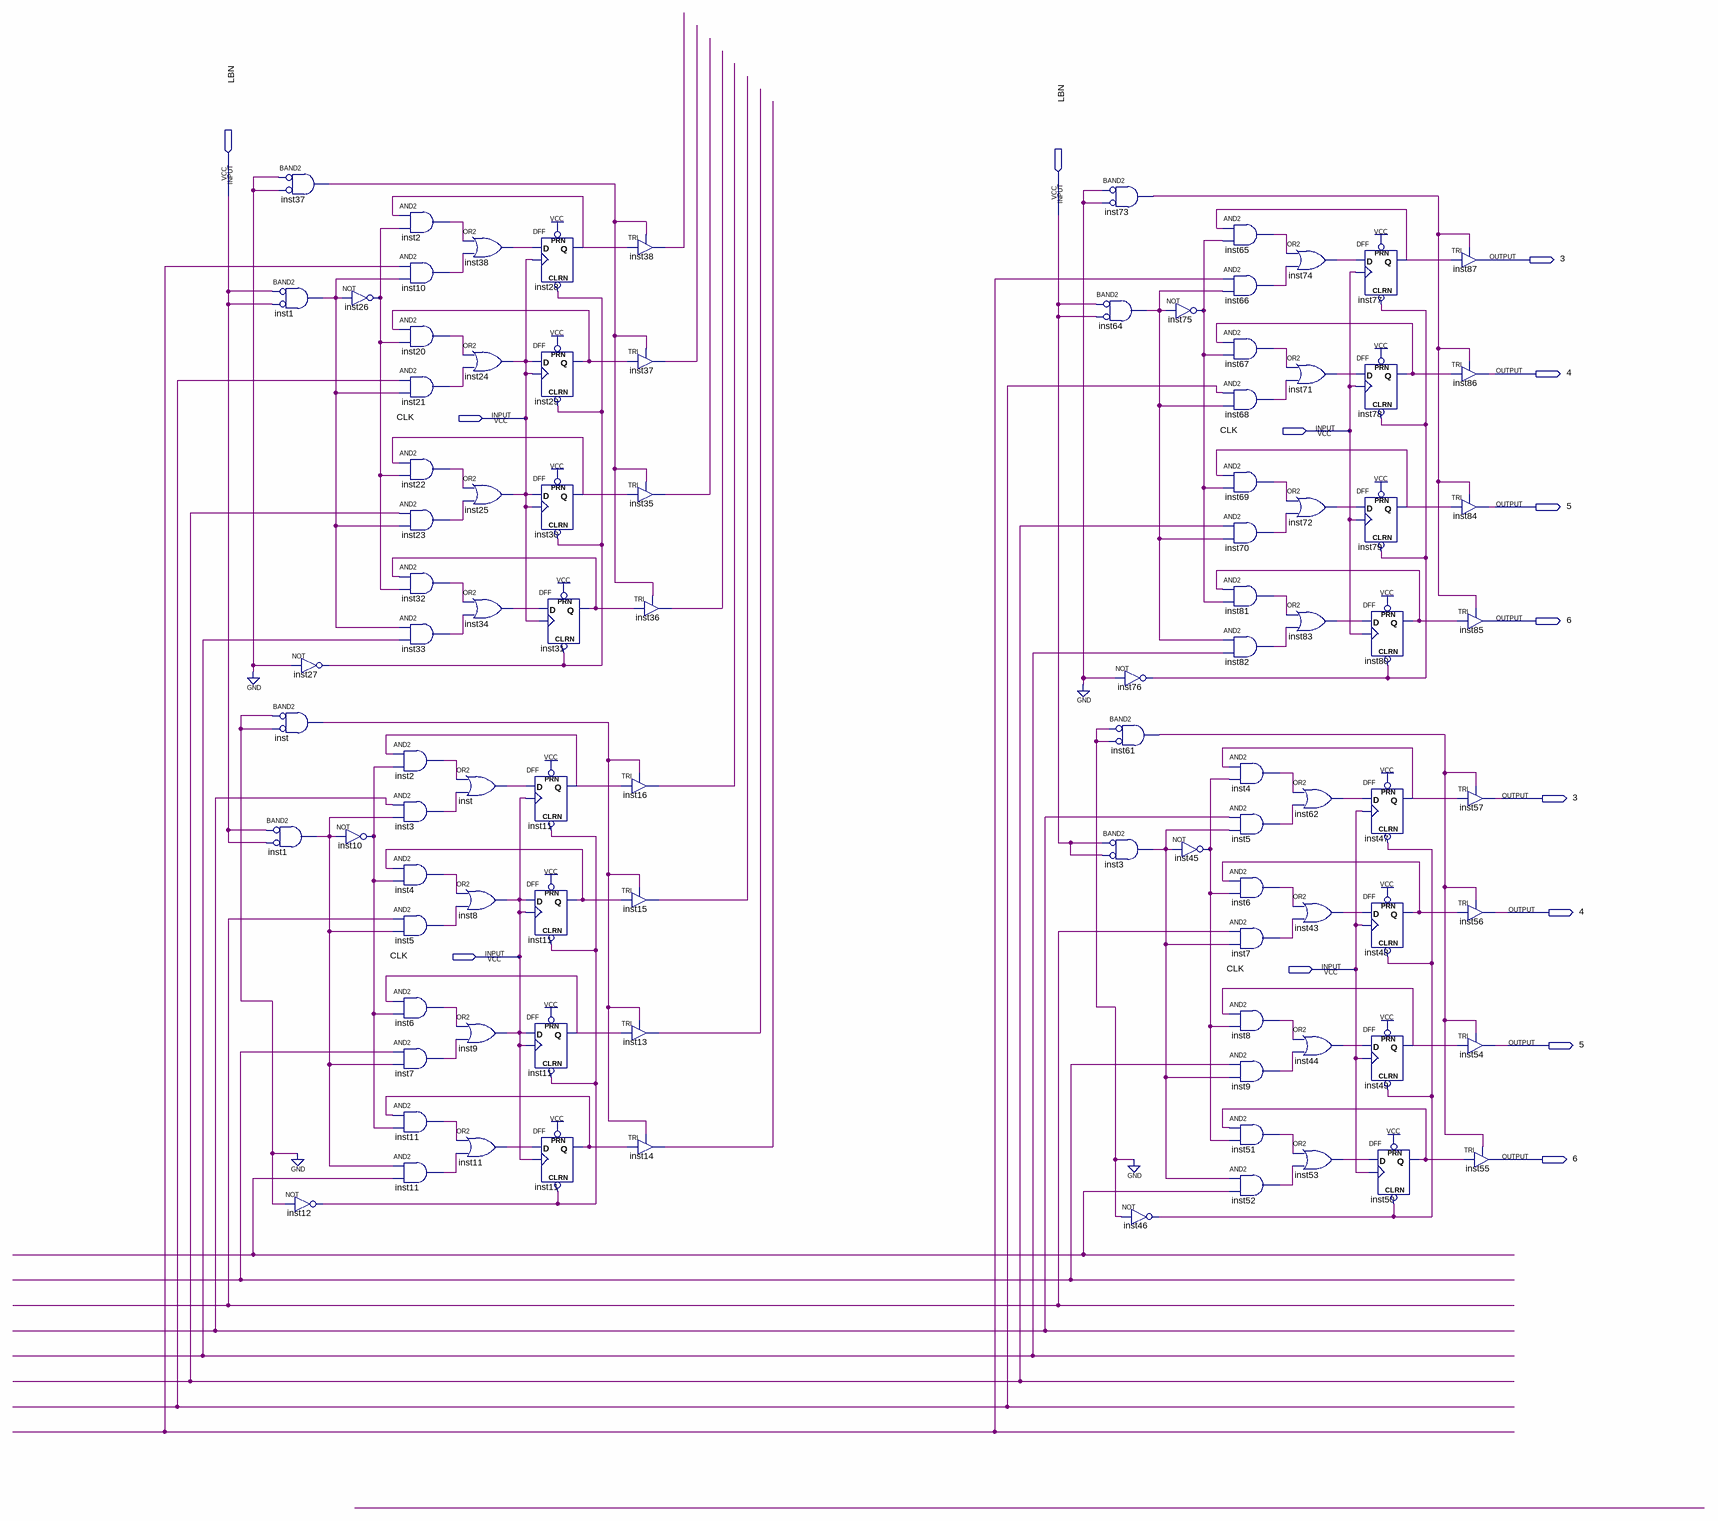
[diagram p0: schematic sheet]
// Quartus schematic Registrator.bdf as structural Verilog: 96 symbols, 14 pins
module Registrator (
  input  LBN,
  input  CLK,
  output \3 ,
  output \4 ,
  output \5 ,
  output \6 
);

  wire inst1_out, inst1_out_2, inst2_out, inst2_out_2, inst3_out, inst3_out_2, inst4_out, inst4_out_2,
       inst5_out, inst5_out_2, inst6_out, inst6_out_2, inst7_out, inst7_out_2, inst8_out, inst9_out,
       inst10_out, inst10_out_2, inst11_out, inst11_out_2, inst11_out_3, inst11_q, inst11_q_2, inst11_q_3,
       inst11_q_4, inst12_out, inst13_out, inst14_out, inst15_out, inst16_out, inst20_out, inst21_out,
       inst22_out, inst23_out, inst26_out, inst27_out, inst28_q, inst29_q, inst30_q, inst31_q, inst32_out,
       inst33_out, inst34_out, inst35_out, inst36_out, inst37_out, inst37_out_2, inst38_out, inst38_out_2,
       inst43_out, inst44_out, inst45_out, inst46_out, inst47_q, inst48_q, inst49_q, inst50_q, inst51_out,
       inst52_out, inst53_out, inst61_out, inst62_out, inst64_out, inst65_out, inst66_out, inst67_out,
       inst68_out, inst69_out, inst70_out, inst71_out, inst72_out, inst73_out, inst74_out, inst75_out,
       inst76_out, inst77_q, inst78_q, inst79_q, inst80_q, inst81_out, inst82_out, inst83_out, inst_out,
       inst_out_2, undriven, undriven_2, undriven_3, undriven_4, undriven_5, undriven_6, undriven_7,
       undriven_8;

  and inst1 (inst1_out_2, ~LBN, ~LBN);  // BAND2
  and inst (inst_out, ~1'b0, ~1'b0);  // BAND2
  and inst1_dup2 (inst1_out, ~LBN, ~LBN);  // BAND2
  and inst37 (inst37_out, ~1'b0, ~1'b0);  // BAND2
  not inst27 (inst27_out, 1'b0);
  not inst12 (inst12_out, 1'b0);
  not inst26 (inst26_out, inst1_out_2);
  not inst10 (inst10_out_2, inst1_out);
  and inst2 (inst2_out_2, inst28_q, inst26_out);
  and inst10_dup2 (inst10_out, undriven_8, inst1_out_2);
  and inst20 (inst20_out, inst29_q, inst26_out);
  and inst21 (inst21_out, undriven_7, inst1_out_2);
  and inst22 (inst22_out, inst30_q, inst26_out);
  and inst23 (inst23_out, undriven_6, inst1_out_2);
  and inst32 (inst32_out, inst31_q, inst26_out);
  and inst33 (inst33_out, inst1_out_2, undriven_5);
  and inst2_dup2 (inst2_out, inst11_q_2, inst10_out_2);
  and inst3 (inst3_out_2, undriven_4, inst1_out);
  and inst4 (inst4_out_2, inst11_q, inst10_out_2);
  and inst5 (inst5_out_2, undriven_3, inst1_out);
  and inst6 (inst6_out_2, inst11_q_3, inst10_out_2);
  and inst7 (inst7_out_2, undriven_2, inst1_out);
  and inst11 (inst11_out, inst11_q_4, inst10_out_2);
  and inst11_dup2 (inst11_out_2, inst1_out, undriven);
  or inst38 (inst38_out, inst2_out_2, inst10_out);
  or inst24 (CLK, inst20_out, inst21_out);
  or inst25 (CLK, inst22_out, inst23_out);
  or inst34 (inst34_out, inst32_out, inst33_out);
  or inst_dup2 (inst_out_2, inst2_out, inst3_out_2);
  or inst8 (CLK, inst4_out_2, inst5_out_2);
  or inst9 (CLK, inst6_out_2, inst7_out_2);
  or inst11_dup3 (inst11_out_3, inst11_out, inst11_out_2);
  DFF inst11_dup4 (.CLRN(inst12_out), .CLK(CLK), .D(inst_out_2), .PRN(1'b1), .Q(inst11_q_2));
  DFF inst11_dup5 (.CLRN(inst12_out), .CLK(CLK), .D(CLK), .PRN(1'b1), .Q(inst11_q));
  DFF inst11_dup6 (.CLRN(inst12_out), .CLK(CLK), .D(CLK), .PRN(1'b1), .Q(inst11_q_3));
  DFF inst28 (.CLRN(inst27_out), .CLK(CLK), .D(inst38_out), .PRN(1'b1), .Q(inst28_q));
  DFF inst29 (.CLRN(inst27_out), .CLK(CLK), .D(CLK), .PRN(1'b1), .Q(inst29_q));
  DFF inst30 (.CLRN(inst27_out), .CLK(CLK), .D(CLK), .PRN(1'b1), .Q(inst30_q));
  DFF inst31 (.CLRN(inst27_out), .CLK(CLK), .D(inst34_out), .PRN(1'b1), .Q(inst31_q));
  DFF inst11_dup7 (.CLRN(inst12_out), .CLK(CLK), .D(inst11_out_3), .PRN(1'b1), .Q(inst11_q_4));
  TRI inst38_dup2 (.IN(inst28_q), .OE(inst37_out), .OUT(inst38_out_2));
  TRI inst37_dup2 (.IN(inst29_q), .OE(inst37_out), .OUT(inst37_out_2));
  TRI inst35 (.IN(inst30_q), .OE(inst37_out), .OUT(inst35_out));
  TRI inst16 (.IN(inst11_q_2), .OE(inst_out), .OUT(inst16_out));
  TRI inst15 (.IN(inst11_q), .OE(inst_out), .OUT(inst15_out));
  TRI inst13 (.IN(inst11_q_3), .OE(inst_out), .OUT(inst13_out));
  TRI inst14 (.IN(inst11_q_4), .OE(inst_out), .OUT(inst14_out));
  TRI inst36 (.IN(inst31_q), .OE(inst37_out), .OUT(inst36_out));
  and inst73 (inst73_out, ~1'b0, ~1'b0);  // BAND2
  and inst64 (inst64_out, ~LBN, ~LBN);  // BAND2
  not inst76 (inst76_out, 1'b0);
  and inst61 (inst61_out, ~1'b0, ~1'b0);  // BAND2
  and inst3_dup2 (inst3_out, ~LBN, ~LBN);  // BAND2
  not inst46 (inst46_out, 1'b0);
  not inst75 (inst75_out, inst64_out);
  not inst45 (inst45_out, inst3_out);
  and inst65 (inst65_out, inst77_q, inst75_out);
  and inst66 (inst66_out, undriven_8, inst64_out);
  and inst67 (inst67_out, inst78_q, inst75_out);
  and inst68 (inst68_out, undriven_7, inst64_out);
  and inst69 (inst69_out, inst79_q, inst75_out);
  and inst70 (inst70_out, undriven_6, inst64_out);
  and inst81 (inst81_out, inst80_q, inst75_out);
  and inst82 (inst82_out, inst64_out, undriven_5);
  and inst4_dup2 (inst4_out, inst47_q, inst45_out);
  and inst5_dup2 (inst5_out, undriven_4, inst3_out);
  and inst6_dup2 (inst6_out, inst48_q, inst45_out);
  and inst7_dup2 (inst7_out, undriven_3, inst3_out);
  and inst8_dup2 (inst8_out, inst49_q, inst45_out);
  and inst9_dup2 (inst9_out, undriven_2, inst3_out);
  and inst51 (inst51_out, inst50_q, inst45_out);
  and inst52 (inst52_out, inst3_out, undriven);
  or inst74 (inst74_out, inst65_out, inst66_out);
  or inst71 (inst71_out, inst67_out, inst68_out);
  or inst72 (inst72_out, inst69_out, inst70_out);
  or inst83 (inst83_out, inst81_out, inst82_out);
  or inst62 (inst62_out, inst4_out, inst5_out);
  or inst43 (inst43_out, inst6_out, inst7_out);
  or inst44 (inst44_out, inst8_out, inst9_out);
  or inst53 (inst53_out, inst51_out, inst52_out);
  DFF inst77 (.CLRN(inst76_out), .CLK(CLK), .D(inst74_out), .PRN(1'b1), .Q(inst77_q));
  DFF inst78 (.CLRN(inst76_out), .CLK(CLK), .D(inst71_out), .PRN(1'b1), .Q(inst78_q));
  DFF inst79 (.CLRN(inst76_out), .CLK(CLK), .D(inst72_out), .PRN(1'b1), .Q(inst79_q));
  DFF inst80 (.CLRN(inst76_out), .CLK(CLK), .D(inst83_out), .PRN(1'b1), .Q(inst80_q));
  DFF inst47 (.CLRN(inst46_out), .CLK(CLK), .D(inst62_out), .PRN(1'b1), .Q(inst47_q));
  DFF inst48 (.CLRN(inst46_out), .CLK(CLK), .D(inst43_out), .PRN(1'b1), .Q(inst48_q));
  DFF inst49 (.CLRN(inst46_out), .CLK(CLK), .D(inst44_out), .PRN(1'b1), .Q(inst49_q));
  DFF inst50 (.CLRN(inst46_out), .CLK(CLK), .D(inst53_out), .PRN(1'b1), .Q(inst50_q));
  TRI inst87 (.IN(inst77_q), .OE(inst73_out), .OUT(\3 ));
  TRI inst86 (.IN(inst78_q), .OE(inst73_out), .OUT(\4 ));
  TRI inst84 (.IN(inst79_q), .OE(inst73_out), .OUT(\5 ));
  TRI inst85 (.IN(inst80_q), .OE(inst73_out), .OUT(\6 ));
  TRI inst57 (.IN(inst47_q), .OE(inst61_out), .OUT(\3 ));
  TRI inst56 (.IN(inst48_q), .OE(inst61_out), .OUT(\4 ));
  TRI inst54 (.IN(inst49_q), .OE(inst61_out), .OUT(\5 ));
  TRI inst55 (.IN(inst50_q), .OE(inst61_out), .OUT(\6 ));
endmodule
